# EAGLE design Orange Board (EAGLE 8.4.3)

## Sheet 1 of 3
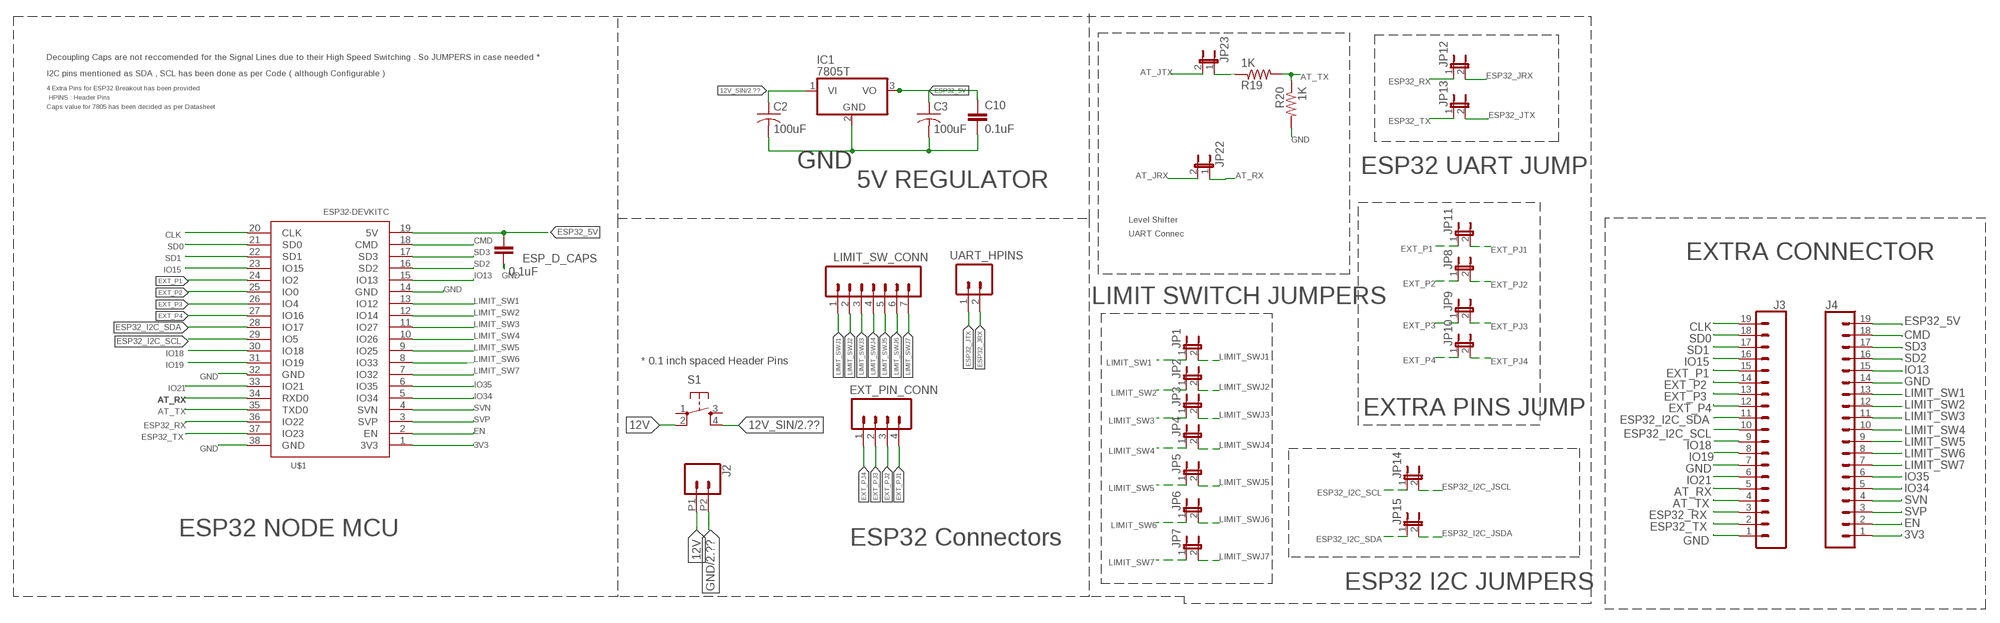
[diagram p0: schematic, sheet 1]

### Parts
C2  100uF  C-US025-024X044  [C025-024X044]
C3  100uF  C-US025-024X044  [C025-024X044]
C10  0.1uF  0.1UF-KIT-EZ-50V-20%  [CAP-PTH-SMALL-KIT]
ESP_D_CAPS  0.1uF  0.1UF-KIT-EZ-50V-20%  [CAP-PTH-SMALL-KIT]
EXT_PIN_CONN  CONN_04  [1X04]
IC1  7805T  [TO220H]
J2  CONN_022.54MM_SCREWTERM  [1X02_2.54_SCREWTERM]
J3  CONN_19  [1X19]
J4  CONN_19  [1X19]
JP1  JUMPER-2PTH  [1X02]
JP2  JUMPER-2PTH  [1X02]
JP3  JUMPER-2PTH  [1X02]
JP4  JUMPER-2PTH  [1X02]
JP5  JUMPER-2PTH  [1X02]
JP6  JUMPER-2PTH  [1X02]
JP7  JUMPER-2PTH  [1X02]
JP8  JUMPER-2PTH  [1X02]
JP9  JUMPER-2PTH  [1X02]
JP10  JUMPER-2PTH  [1X02]
JP11  JUMPER-2PTH  [1X02]
JP12  JUMPER-2PTH  [1X02]
JP13  JUMPER-2PTH  [1X02]
JP14  JUMPER-2PTH  [1X02]
JP15  JUMPER-2PTH  [1X02]
JP22  JUMPER-2PTH  [1X02]
JP23  JUMPER-2PTH  [1X02]
LIMIT_SW_CONN  CONN_07  [1X07]
R19  1K  R-US_0204/5  [0204/5]
R20  1K  R-US_0204/5  [0204/5]
S1  TAC_SWITCHPTH  [TACTILE-PTH]
U$1  ESP32DEVKITC  [ESP32-DEVKITC]
UART_HPINS  CONN_02  [1X02]

### Nets
3V3: J4.1 U$1.1(3V3)
12V: J2.P1 S1.2
12V_SIN: C2.1 IC1.1(VI) S1.4 ; also sheet 2,3
AT_JRX: JP22.2 ; also sheet 3
AT_JTX: JP23.2 ; also sheet 3
AT_RX: J3.5 JP22.1 U$1.34(RXD0)
AT_TX: J3.4 R19.2 R20.1 U$1.35(TXD0)
CLK: J3.19 U$1.20(CLK)
CMD: J4.18 U$1.18(CMD)
EN: J4.2 U$1.2(EN)
ESP32_5V: C3.1 C10.1 ESP_D_CAPS.1 IC1.3(VO) J4.19 U$1.19(5V)
ESP32_I2C_JSCL: JP14.2 ; also sheet 2
ESP32_I2C_JSDA: JP15.2 ; also sheet 2
ESP32_I2C_SCL: J3.10 JP14.1 U$1.29(IO5)
ESP32_I2C_SDA: J3.11 JP15.1 U$1.28(IO17)
ESP32_JRX: JP12.2 UART_HPINS.2
ESP32_JTX: JP13.2 UART_HPINS.1
ESP32_RX: J3.3 JP12.1 U$1.36(IO22)
ESP32_TX: J3.2 JP13.1 U$1.37(IO23)
EXT_P1: J3.15 JP11.1 U$1.24(IO2)
EXT_P2: J3.14 JP8.1 U$1.25(IO0)
EXT_P3: J3.13 JP9.1 U$1.26(IO4)
EXT_P4: J3.12 JP10.1 U$1.27(IO16)
EXT_PJ1: EXT_PIN_CONN.4 JP11.2
EXT_PJ2: EXT_PIN_CONN.3 JP8.2
EXT_PJ3: EXT_PIN_CONN.2 JP9.2
EXT_PJ4: EXT_PIN_CONN.1 JP10.2
GND: C2.2 C3.2 C10.2 ESP_D_CAPS.2 IC1.2(GND) J2.P2 J3.1 J3.7 J4.14 R20.2 U$1.14(GND) U$1.32(GND) U$1.38(GND) ; also sheet 2,3
IO13: J4.15 U$1.15(IO13)
IO15: J3.16 U$1.23(IO15)
IO18: J3.9 U$1.30(IO18)
IO19: J3.8 U$1.31(IO19)
IO21: J3.6 U$1.33(IO21)
IO34: J4.5 U$1.5(IO34)
IO35: J4.6 U$1.6(IO35)
LIMIT_SW1: J4.13 JP1.1 U$1.13(IO12)
LIMIT_SW2: J4.12 JP2.1 U$1.12(IO14)
LIMIT_SW3: J4.11 JP3.1 U$1.11(IO27)
LIMIT_SW4: J4.10 JP4.1 U$1.10(IO26)
LIMIT_SW5: J4.9 JP5.1 U$1.9(IO25)
LIMIT_SW6: J4.8 JP6.1 U$1.8(IO33)
LIMIT_SW7: J4.7 JP7.1 U$1.7(IO32)
LIMIT_SWJ1: JP1.2 LIMIT_SW_CONN.1
LIMIT_SWJ2: JP2.2 LIMIT_SW_CONN.2
LIMIT_SWJ3: JP3.2 LIMIT_SW_CONN.3
LIMIT_SWJ4: JP4.2 LIMIT_SW_CONN.4
LIMIT_SWJ5: JP5.2 LIMIT_SW_CONN.5
LIMIT_SWJ6: JP6.2 LIMIT_SW_CONN.6
LIMIT_SWJ7: JP7.2 LIMIT_SW_CONN.7
N$16: JP23.1 R19.1
SD0: J3.18 U$1.21(SD0)
SD1: J3.17 U$1.22(SD1)
SD2: J4.16 U$1.16(SD2)
SD3: J4.17 U$1.17(SD3)
SVN: J4.4 U$1.4(SVN)
SVP: J4.3 U$1.3(SVP)
Unconnected: S1.1 S1.3

### Notes on the sheet
- Decoupling Caps are not reccomended for the Signal Lines due to their High Speed Switching . So JUMPERS in case needed *
- I2C pins mentioned as SDA , SCL has been done as per Code ( although Configurable )
- 4 Extra Pins for ESP32 Breakout has been provided
- HPINS : Header Pins
- Caps value for 7805 has been decided as per Datasheet
- ESP32 UART JUMP
- 5V REGULATOR
- Level Shifter
- UART Connec
- EXTRA CONNECTOR
- LIMIT SWITCH JUMPERS
- * 0.1 inch spaced Header Pins
- EXTRA PINS JUMP
- ESP32 NODE MCU
- ESP32 Connectors
- ESP32 I2C JUMPERS

## Sheet 2 of 3
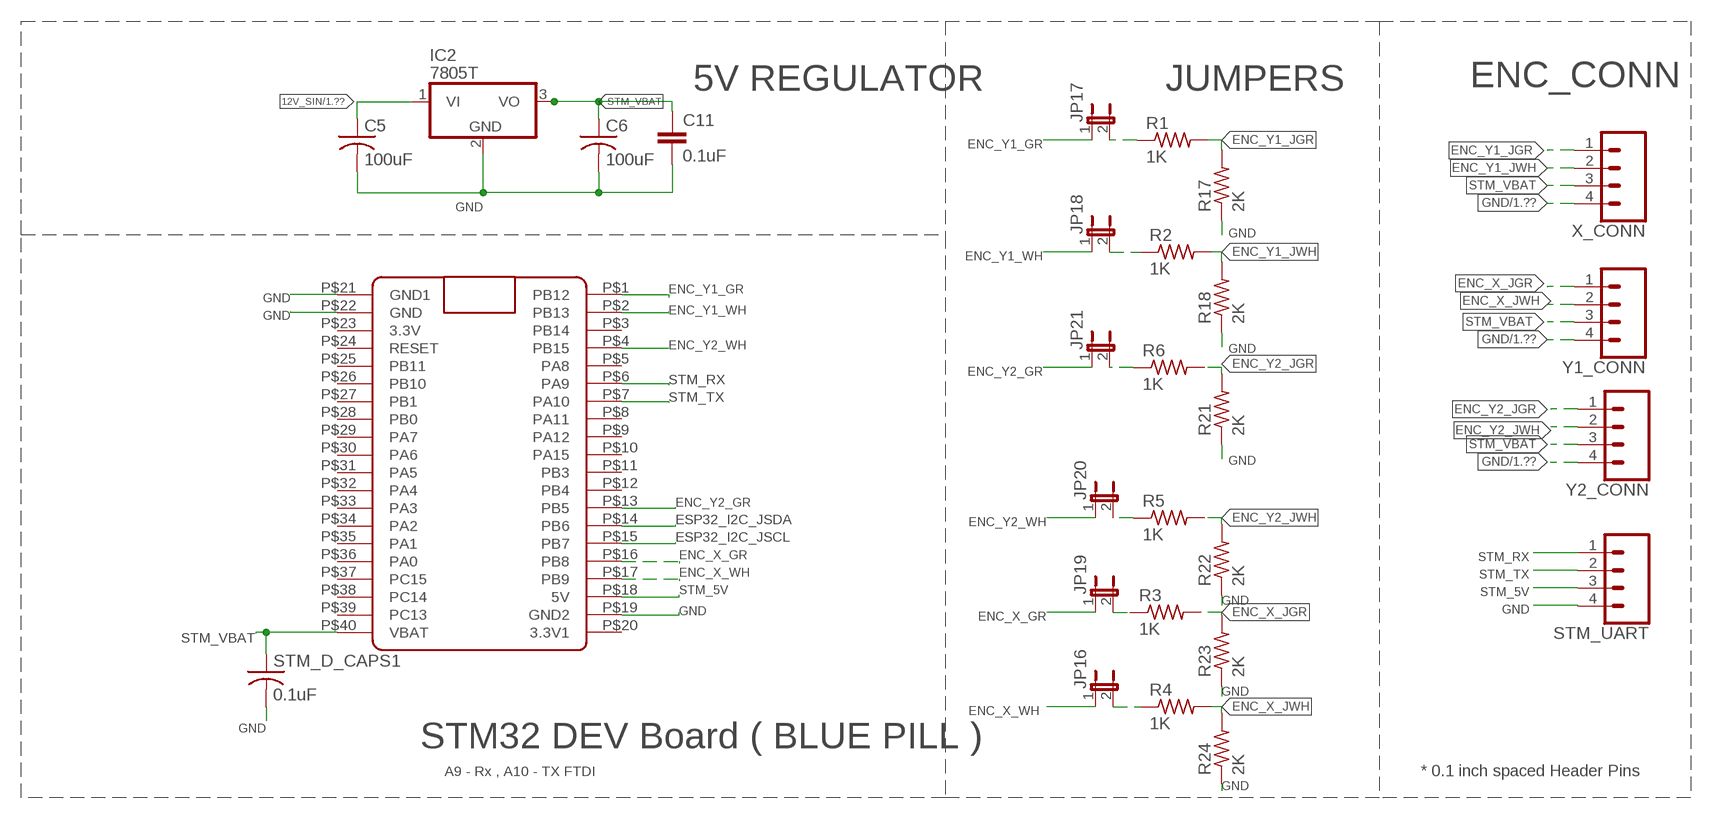
[diagram p1: schematic, sheet 2]

### Parts
C5  100uF  C-US025-024X044  [C025-024X044]
C6  100uF  C-US025-024X044  [C025-024X044]
C11  0.1uF  0.1UF-KIT-EZ-50V-20%  [CAP-PTH-SMALL-KIT]
IC2  7805T  [TO220H]
JP16  JUMPER-2PTH  [1X02]
JP17  JUMPER-2PTH  [1X02]
JP18  JUMPER-2PTH  [1X02]
JP19  JUMPER-2PTH  [1X02]
JP20  JUMPER-2PTH  [1X02]
JP21  JUMPER-2PTH  [1X02]
R1  1K  R-US_0204/5  [0204/5]
R2  1K  R-US_0204/5  [0204/5]
R3  1K  R-US_0204/5  [0204/5]
R4  1K  R-US_0204/5  [0204/5]
R5  1K  R-US_0204/5  [0204/5]
R6  1K  R-US_0204/5  [0204/5]
R17  2K  R-US_0204/5  [0204/5]
R18  2K  R-US_0204/5  [0204/5]
R21  2K  R-US_0204/5  [0204/5]
R22  2K  R-US_0204/5  [0204/5]
R23  2K  R-US_0204/5  [0204/5]
R24  2K  R-US_0204/5  [0204/5]
STM_D_CAPS1  0.1uF  C-US025-024X044  [C025-024X044]
STM_UART  CONN_04  [1X04]
U$2  BLUE_PILLADVANCED  [BLUE_PILL_ADV]
X_CONN  CONN_04  [1X04]
Y1_CONN  CONN_04  [1X04]
Y2_CONN  CONN_04  [1X04]

### Nets
12V_SIN: C5.1 IC2.1(VI) ; also sheet 1,3
ENC_X_GR: JP19.1 U$2.P$16(PB8)
ENC_X_JGR: R3.2 R23.2 Y1_CONN.1
ENC_X_JWH: R4.2 R24.2 Y1_CONN.2
ENC_X_WH: JP16.1 U$2.P$17(PB9)
ENC_Y1_GR: JP17.1 U$2.P$1(PB12)
ENC_Y1_JGR: R1.2 R17.2 X_CONN.1
ENC_Y1_JWH: R2.2 R18.2 X_CONN.2
ENC_Y1_WH: JP18.1 U$2.P$2(PB13)
ENC_Y2_GR: JP21.1 U$2.P$13(PB5)
ENC_Y2_JGR: R6.2 R21.2 Y2_CONN.1
ENC_Y2_JWH: R5.2 R22.2 Y2_CONN.2
ENC_Y2_WH: JP20.1 U$2.P$4(PB15)
ESP32_I2C_JSCL: U$2.P$15(PB7) ; also sheet 1
ESP32_I2C_JSDA: U$2.P$14(PB6) ; also sheet 1
GND: C5.2 C6.2 C11.2 IC2.2(GND) R17.1 R18.1 R21.1 R22.1 R23.1 R24.1 STM_D_CAPS1.2 STM_UART.4 U$2.P$19(GND2) U$2.P$21(GND1) U$2.P$22(GND) X_CONN.4 Y1_CONN.4 Y2_CONN.4 ; also sheet 1,3
N$14: JP19.2 R3.1
N$15: JP16.2 R4.1
N$17: JP18.2 R2.1
N$18: JP17.2 R1.1
N$19: JP21.2 R6.1
N$20: JP20.2 R5.1
STM_5V: STM_UART.3 U$2.P$18(5V)
STM_RX: STM_UART.1 U$2.P$6(PA9)
STM_TX: STM_UART.2 U$2.P$7(PA10)
STM_VBAT: C6.1 C11.1 IC2.3(VO) STM_D_CAPS1.1 U$2.P$40(VBAT) X_CONN.3 Y1_CONN.3 Y2_CONN.3
Unconnected: U$2.P$3(PB14) U$2.P$5(PA8) U$2.P$8(PA11) U$2.P$9(PA12) U$2.P$10(PA15) U$2.P$11(PB3) U$2.P$12(PB4) U$2.P$20(3.3V1) U$2.P$23(3.3V) U$2.P$24(RESET) U$2.P$25(PB11) U$2.P$26(PB10) U$2.P$27(PB1) U$2.P$28(PB0) U$2.P$29(PA7) U$2.P$30(PA6) U$2.P$31(PA5) U$2.P$32(PA4) U$2.P$33(PA3) U$2.P$34(PA2) U$2.P$35(PA1) U$2.P$36(PA0) U$2.P$37(PC15) U$2.P$38(PC14) U$2.P$39(PC13)

### Notes on the sheet
- 5V REGULATOR | JUMPERS | ENC_CONN
- STM32 DEV Board ( BLUE PILL )
- A9 - Rx , A10 - TX FTDI | * 0.1 inch spaced Header Pins

## Sheet 3 of 3
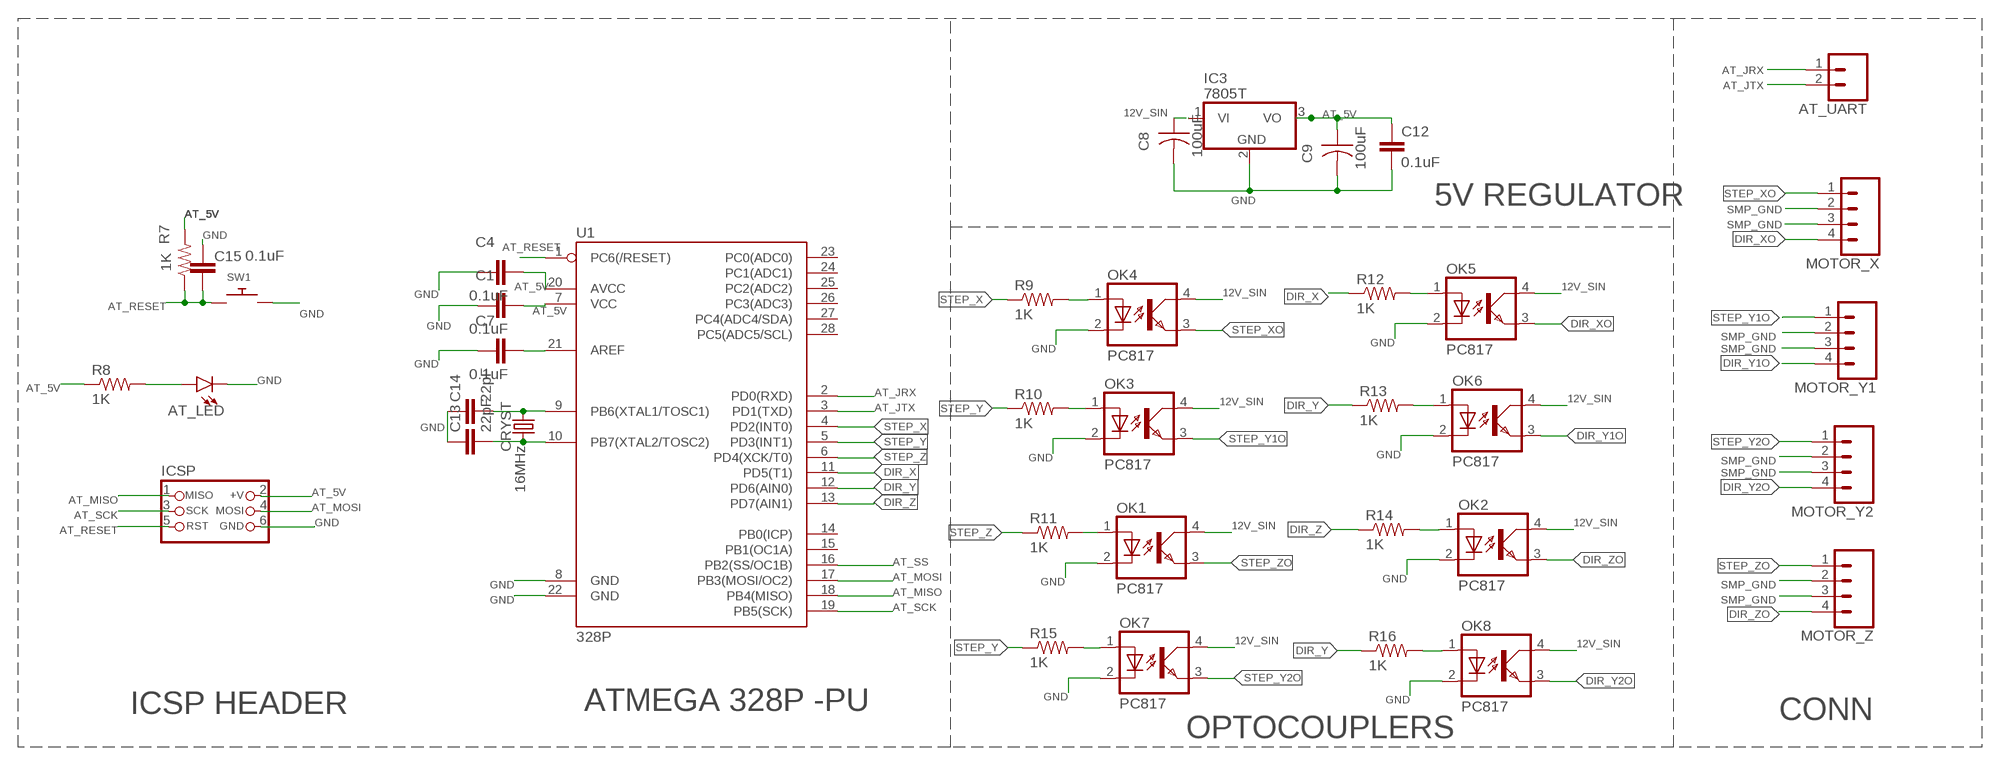
[diagram p2: schematic, sheet 3]

### Parts
AT_LED  LED-3MM-NO_SILK  [LED_3MM-NS]
AT_UART  CONN_02  [1X02]
C1  0.1uF  0.1UF-KIT-EZ-50V-20%  [CAP-PTH-SMALL-KIT]
C4  0.1uF  0.1UF-KIT-EZ-50V-20%  [CAP-PTH-SMALL-KIT]
C7  0.1uF  0.1UF-KIT-EZ-50V-20%  [CAP-PTH-SMALL-KIT]
C8  100uF  C-US025-024X044  [C025-024X044]
C9  100uF  C-US025-024X044  [C025-024X044]
C12  0.1uF  0.1UF-KIT-EZ-50V-20%  [CAP-PTH-SMALL-KIT]
C13  22pF  22PF-PTH-2.54MM-200V-5%  [CAP-PTH-2.54]
C14  22pF  22PF-PTH-2.54MM-200V-5%  [CAP-PTH-2.54]
C15  0.1uF  0.1UF-KIT-EZ-50V-20%  [CAP-PTH-SMALL-KIT]
CRYST  16MHz  CRYSTAL-16MHZPTH-HC49US  [HC49US]
IC3  7805T  [TO220H]
ICSP  CON_HEADER_PRG_AVR_ICSP-PTH  [HEADER_PRG_2X03]
MOTOR_X  CONN_04  [1X04]
MOTOR_Y1  CONN_04  [1X04]
MOTOR_Y2  CONN_04  [1X04]
MOTOR_Z  CONN_04  [1X04]
OK1  PC817  [DIL04]
OK2  PC817  [DIL04]
OK3  PC817  [DIL04]
OK4  PC817  [DIL04]
OK5  PC817  [DIL04]
OK6  PC817  [DIL04]
OK7  PC817  [DIL04]
OK8  PC817  [DIL04]
R7  1K  R-US_0204/5  [0204/5]
R8  1K  R-US_0204/5  [0204/5]
R9  1K  R-US_0204/5  [0204/5]
R10  1K  R-US_0204/5  [0204/5]
R11  1K  R-US_0204/5  [0204/5]
R12  1K  R-US_0204/5  [0204/5]
R13  1K  R-US_0204/5  [0204/5]
R14  1K  R-US_0204/5  [0204/5]
R15  1K  R-US_0204/5  [0204/5]
R16  1K  R-US_0204/5  [0204/5]
SW1  SWITCH_PUSHBUTTONEVQ-PE  [TACT_PANA-EVQ]
U1  328P  ATMEGA328P_PDIP  [DIP28]

### Nets
12V_SIN: C8.1 IC3.1(VI) OK1.4(COL) OK2.4(COL) OK3.4(COL) OK4.4(COL) OK5.4(COL) OK6.4(COL) OK7.4(COL) OK8.4(COL) ; also sheet 1,2
AT_5V: C1.1 C4.1 C9.1 C12.1 IC3.3(VO) ICSP.2(+V) R7.2 R8.1 U1.7(VCC) U1.20(AVCC)
AT_JRX: AT_UART.1 U1.2(PD0(RXD)) ; also sheet 1
AT_JTX: AT_UART.2 U1.3(PD1(TXD)) ; also sheet 1
AT_MISO: ICSP.1(MISO) U1.18(PB4(MISO))
AT_MOSI: ICSP.4(MOSI) U1.17(PB3(MOSI/OC2))
AT_RESET: C15.1 ICSP.5(RST) R7.1 SW1.P$1 U1.1(PC6(/RESET))
AT_SCK: ICSP.3(SCK) U1.19(PB5(SCK))
AT_SS: U1.16(PB2(SS/OC1B))
DIR_X: R12.1 U1.11(PD5(T1))
DIR_XO: MOTOR_X.4 OK5.3(EMIT)
DIR_Y: R13.1 R16.1 U1.12(PD6(AIN0))
DIR_Y1O: MOTOR_Y1.4 OK6.3(EMIT)
DIR_Y2O: MOTOR_Y2.4 OK8.3(EMIT)
DIR_Z: R14.1 U1.13(PD7(AIN1))
DIR_ZO: MOTOR_Z.4 OK2.3(EMIT)
GND: AT_LED.K(C) C1.2 C4.2 C7.2 C8.2 C9.2 C12.2 C13.1 C14.1 C15.2 IC3.2(GND) ICSP.6(GND) OK1.2(C) OK2.2(C) OK3.2(C) OK4.2(C) OK5.2(C) OK6.2(C) OK7.2(C) OK8.2(C) SW1.P$2 U1.8(GND) U1.22(GND) ; also sheet 1,2
N$1: C13.2 CRYST.1 U1.10(PB7(XTAL2/TOSC2))
N$2: C14.2 CRYST.2 U1.9(PB6(XTAL1/TOSC1))
N$3: AT_LED.A R8.2
N$5: C7.1 U1.21(AREF)
N$6: OK4.1(A) R9.2
N$7: OK3.1(A) R10.2
N$8: OK1.1(A) R11.2
N$9: OK5.1(A) R12.2
N$10: OK2.1(A) R14.2
N$11: OK6.1(A) R13.2
N$12: OK7.1(A) R15.2
N$13: OK8.1(A) R16.2
SMP_GND: MOTOR_X.2 MOTOR_X.3 MOTOR_Y1.2 MOTOR_Y1.3 MOTOR_Y2.2 MOTOR_Y2.3 MOTOR_Z.2 MOTOR_Z.3
STEP_X: R9.1 U1.4(PD2(INT0))
STEP_XO: MOTOR_X.1 OK4.3(EMIT)
STEP_Y: R10.1 R15.1 U1.5(PD3(INT1))
STEP_Y1O: MOTOR_Y1.1 OK3.3(EMIT)
STEP_Y2O: MOTOR_Y2.1 OK7.3(EMIT)
STEP_Z: R11.1 U1.6(PD4(XCK/T0))
STEP_ZO: MOTOR_Z.1 OK1.3(EMIT)
Unconnected: U1.14(PB0(ICP)) U1.15(PB1(OC1A)) U1.23(PC0(ADC0)) U1.24(PC1(ADC1)) U1.25(PC2(ADC2)) U1.26(PC3(ADC3)) U1.27(PC4(ADC4/SDA)) U1.28(PC5(ADC5/SCL))

### Notes on the sheet
- 5V REGULATOR
- ICSP HEADER | ATMEGA 328P -PU | CONN
- OPTOCOUPLERS

## Library data of the parts
AT_LED = SparkFun-LED:LED: LED (Generic) Standard schematic elements and footprints for 5mm, 3mm, 1206, and 0603 sized LEDs. Generic LEDs with no color specified.
AT_UART J2 UART_HPINS = SparkFun-Connectors:CONN_02: Multi connection point. Often used as Generic Header-pin footprint for 0.1 inch spaced/style header connections On any of the 0.1 inch spaced packages, you can populate with these: Break Away Headers - Straight <https://www.sparkfun.com/products/116> (PRT-00116) Break Away Male Headers - Right Angle <https://www.sparkfun.com/products/553> (PRT-00553) Female Headers <https://www.sparkfun.com/products/115> (PRT-00115) Break Away Headers - Machine Pin <https://www.sparkfun.com/products/117> (PRT-00117) Break Away Female Headers - Swiss Machine Pin <https://www.sparkfun.com/products/743> (PRT-00743) For SCREWTERMINALS and SPRING TERMINALS visit here: Screw Terimnals on SparkFun.com <https://www.sparkfun.com/search/results?term=Screw+Terminals> (5mm/3.5mm/2.54mm spacing) This device is also useful as a general connection point to wire up your design to another part of your project. Our various solder wires solder well into these plated through hole pads. Hook-Up Wire - Assortment (Stranded, 22 AWG) <https://www.sparkfun.com/products/11375> (PRT-11375) Hook-Up Wire - Assortment (Solid Core, 22 AWG) <https://www.sparkfun.com/products/11367> (PRT-11367) View the entire wire category on our website here <https://www.sparkfun.com/categories/141> Special notes: Molex polarized connector foot print use with: PRT-08233 with associated crimp pins and housings. 2.54_SCREWTERM for use with PRT-10571. 3.5mm Screw Terminal footprints for PRT-08084 5mm Screw Terminal footprints for use with PRT-08432
C1 C4 C7 C10-C12 C15 ESP_D_CAPS = SparkFun-Capacitors:0.1UF: 0.1µF ceramic capacitors A capacitor is a passive two-terminal electrical component used to store electrical energy temporarily in an electric field.; PROD_ID: CAP-08370
C2 C3 C5 C6 C8 C9 STM_D_CAPS1 = adafruit:C-US: CAPACITOR, American symbol
C13 C14 = SparkFun-Capacitors:22PF: 22pF ceramic capacitors A capacitor is a passive two-terminal electrical component used to store electrical energy temporarily in an electric field.; PROD_ID: CAP-09128
CRYST = SparkFun-Clocks:CRYSTAL-16MHZ: 16MHz Crystal Digikey Example <http://www.digikey.com/product-search/en?keywords=535-9122-1-ND> Frequency: 16MHz Frequency Stability: ±50ppm Frequency Tolerance: ±20ppm Load Capacitance: 18pF SparkFun Products: Pro Micro -5V/16MHz <https://www.sparkfun.com/products/12640> SparkFun Serial Enabled LCD Kit <https://www.sparkfun.com/products/10097>; PROD_ID: XTAL-08181; SF_ID: COM-00536
EXT_PIN_CONN MOTOR_X MOTOR_Y1 MOTOR_Y2 MOTOR_Z STM_UART X_CONN Y1_CONN Y2_CONN = SparkFun-Connectors:CONN_04: Multi connection point. Often used as Generic Header-pin footprint for 0.1 inch spaced/style header connections On any of the 0.1 inch spaced packages, you can populate with these: Break Away Headers - Straight <https://www.sparkfun.com/products/116> (PRT-00116) Break Away Male Headers - Right Angle <https://www.sparkfun.com/products/553> (PRT-00553) Female Headers <https://www.sparkfun.com/products/115> (PRT-00115) Break Away Headers - Machine Pin <https://www.sparkfun.com/products/117> (PRT-00117) Break Away Female Headers - Swiss Machine Pin <https://www.sparkfun.com/products/743> (PRT-00743) For SCREWTERMINALS and SPRING TERMINALS visit here: Screw Terimnals on SparkFun.com <https://www.sparkfun.com/search/results?term=Screw+Terminals> (5mm/3.5mm/2.54mm spacing) This device is also useful as a general connection point to wire up your design to another part of your project. Our various solder wires solder well into these plated through hole pads. Hook-Up Wire - Assortment (Stranded, 22 AWG) <https://www.sparkfun.com/products/11375> (PRT-11375) Hook-Up Wire - Assortment (Solid Core, 22 AWG) <https://www.sparkfun.com/products/11367> (PRT-11367) View the entire wire category on our website here <https://www.sparkfun.com/categories/141> Special notes: Molex polarized connector foot print use with SKU : PRT-08231 with associated crimp pins and housings. 1MM SMD Version SKU: PRT-10208; PROD_ID: CONN-09696
IC1-IC3 = adafruit:78*: Positive VOLTAGE REGULATOR Added bigger pads to the TO-92 package
ICSP = dp_devices:CON_HEADER_PRG_AVR_ICSP: 2x3 AVR ICSP programming header
J3 J4 = SparkFun-Connectors:CONN_19: Multi connection point. Often used as Generic Header-pin footprint for 0.1 inch spaced/style header connections On any of the 0.1 inch spaced packages, you can populate with these: Break Away Headers - Straight <https://www.sparkfun.com/products/116> (PRT-00116) Break Away Male Headers - Right Angle <https://www.sparkfun.com/products/553> (PRT-00553) Female Headers <https://www.sparkfun.com/products/115> (PRT-00115) Break Away Headers - Machine Pin <https://www.sparkfun.com/products/117> (PRT-00117) Break Away Female Headers - Swiss Machine Pin <https://www.sparkfun.com/products/743> (PRT-00743) For SCREWTERMINALS and SPRING TERMINALS visit here: Screw Terimnals on SparkFun.com <https://www.sparkfun.com/search/results?term=Screw+Terminals> (5mm/3.5mm/2.54mm spacing) This device is also useful as a general connection point to wire up your design to another part of your project. Our various solder wires solder well into these plated through hole pads. Hook-Up Wire - Assortment (Stranded, 22 AWG) <https://www.sparkfun.com/products/11375> (PRT-11375) Hook-Up Wire - Assortment (Solid Core, 22 AWG) <https://www.sparkfun.com/products/11367> (PRT-11367) View the entire wire category on our website here <https://www.sparkfun.com/categories/141> Special notes: Molex polarized connector foot print use with SKU : PRT-08231 with associated crimp pins and housings. 1MM SMD Version SKU: PRT-10208 NOTES ON THE VARIANTS LOCK and LOCK_LONGPADS... This footprint was designed to help hold the alignment of a through-hole component (i.e. 6-pin header) while soldering it into place. You may notice that each hole has been shifted either up or down by 0.005 of an inch from it's more standard position (which is a perfectly straight line). This slight alteration caused the pins (the squares in the middle) to touch the edges of the holes. Because they are alternating, it causes a "brace" to hold the component in place. 0.005 has proven to be the perfect amount of "off-center" position when using our standard breakaway headers. Although looks a little odd when you look at the bare footprint, once you have a header in there, the alteration is very hard to notice. Also,if you push a header all the way into place, it is covered up entirely on the bottom side.
JP1-JP23 = SparkFun-Retired:JUMPER-2: Jumper Basic 0.1" spaced jumper. Use with breakaway headers.
LIMIT_SW_CONN = SparkFun-Connectors:CONN_07: Multi connection point. Often used as Generic Header-pin footprint for 0.1 inch spaced/style header connections On any of the 0.1 inch spaced packages, you can populate with these: Break Away Headers - Straight <https://www.sparkfun.com/products/116> (PRT-00116) Break Away Male Headers - Right Angle <https://www.sparkfun.com/products/553> (PRT-00553) Female Headers <https://www.sparkfun.com/products/115> (PRT-00115) Break Away Headers - Machine Pin <https://www.sparkfun.com/products/117> (PRT-00117) Break Away Female Headers - Swiss Machine Pin <https://www.sparkfun.com/products/743> (PRT-00743) For SCREWTERMINALS and SPRING TERMINALS visit here: Screw Terimnals on SparkFun.com <https://www.sparkfun.com/search/results?term=Screw+Terminals> (5mm/3.5mm/2.54mm spacing) This device is also useful as a general connection point to wire up your design to another part of your project. Our various solder wires solder well into these plated through hole pads. Hook-Up Wire - Assortment (Stranded, 22 AWG) <https://www.sparkfun.com/products/11375> (PRT-11375) Hook-Up Wire - Assortment (Solid Core, 22 AWG) <https://www.sparkfun.com/products/11367> (PRT-11367) View the entire wire category on our website here <https://www.sparkfun.com/categories/141> Special notes: Molex polarized connector foot print use with SKU : PRT-08231 with associated crimp pins and housings. 1MM SMD Version SKU: PRT-10208 NOTES ON THE VARIANTS LOCK and LOCK_LONGPADS... This footprint was designed to help hold the alignment of a through-hole component (i.e. 6-pin header) while soldering it into place. You may notice that each hole has been shifted either up or down by 0.005 of an inch from it's more standard position (which is a perfectly straight line). This slight alteration caused the pins (the squares in the middle) to touch the edges of the holes. Because they are alternating, it causes a "brace" to hold the component in place. 0.005 has proven to be the perfect amount of "off-center" position when using our standard breakaway headers. Although looks a little odd when you look at the bare footprint, once you have a header in there, the alteration is very hard to notice. Also,if you push a header all the way into place, it is covered up entirely on the bottom side.
OK1-OK8 = optocoupler:PC817: SHARP OPTO COUPLER; MPN: PC817X4J000F; OC_FARNELL: 9707727; OC_NEWARK: 97K7059
R1-R24 = resistor:R-US_: RESISTOR, American symbol
S1 = SparkFun-Retired:TAC_SWITCH: Momentary Switch Button commonly used for reset or general input. Spark Fun Electronics SKU : COM-00097 SMT- SWCH-08247
SW1 = adafruit:SWITCH_PUSHBUTTON: Buttons SOFTTOUCHSMD_SJ - Soft touch temporary push button (Super Junk Akihabara) Compatible with SKPMANE010 [Mouser: 688-SKPMAN] C&K_KSS = Digikey: KSS221GLFS
U1 = SparkFun-IC-Microcontroller:ATMEGA328P_PDIP: Atmel 328P Through hole ATMEGA328P uC used in the Arduino 32kb flash, 1k EEPROM, 2k SRAM Datasheet <http://www.sparkfun.com/datasheets/Components/SMD/ATMega328.pdf> SparkFun Products Storefront component: AVR 28 Pin 20MHz 32K 6A/D - ATMega328P <https://www.sparkfun.com/products/9061> (COM-09061) SparkFun Simon Says - Through-Hole Soldering Kit <https://www.sparkfun.com/products/10547> (KIT-10547) SparkFun Learn to Solder - Simon Says <https://www.sparkfun.com/products/13708> (KIT-13708) SparkFun BigTime Watch Kit <https://www.sparkfun.com/products/11734> (KIT-11734) SparkFun ClockIt <https://www.sparkfun.com/products/10930> (KIT-10930) SparkFun Serial Enabled LCD Kit <https://www.sparkfun.com/products/10097> (LCD-10097) SparkFun Simon Tilts - Through Hole Soldering Kit <https://www.sparkfun.com/products/12634> (KIT-12634) SparkFun Frequency Counter Kit <https://www.sparkfun.com/products/10140> (KIT-10140) FabFM Radio Kit <https://www.sparkfun.com/products/11043> (KIT-11043) SparkFun Binary Blaster Kit <https://www.sparkfun.com/products/12037> (KIT-12037) SparkFun Metro-Gnome <https://www.sparkfun.com/products/9236> (KIT-09236) ATmega328 with Arduino Optiboot (Uno) <https://www.sparkfun.com/products/10524> (DEV-10524); PROD_ID: IC-09136
U$1 = ESP32-DEVKITC:ESP32DEVKITC
U$2 = BluePill:BLUE_PILL

## Board
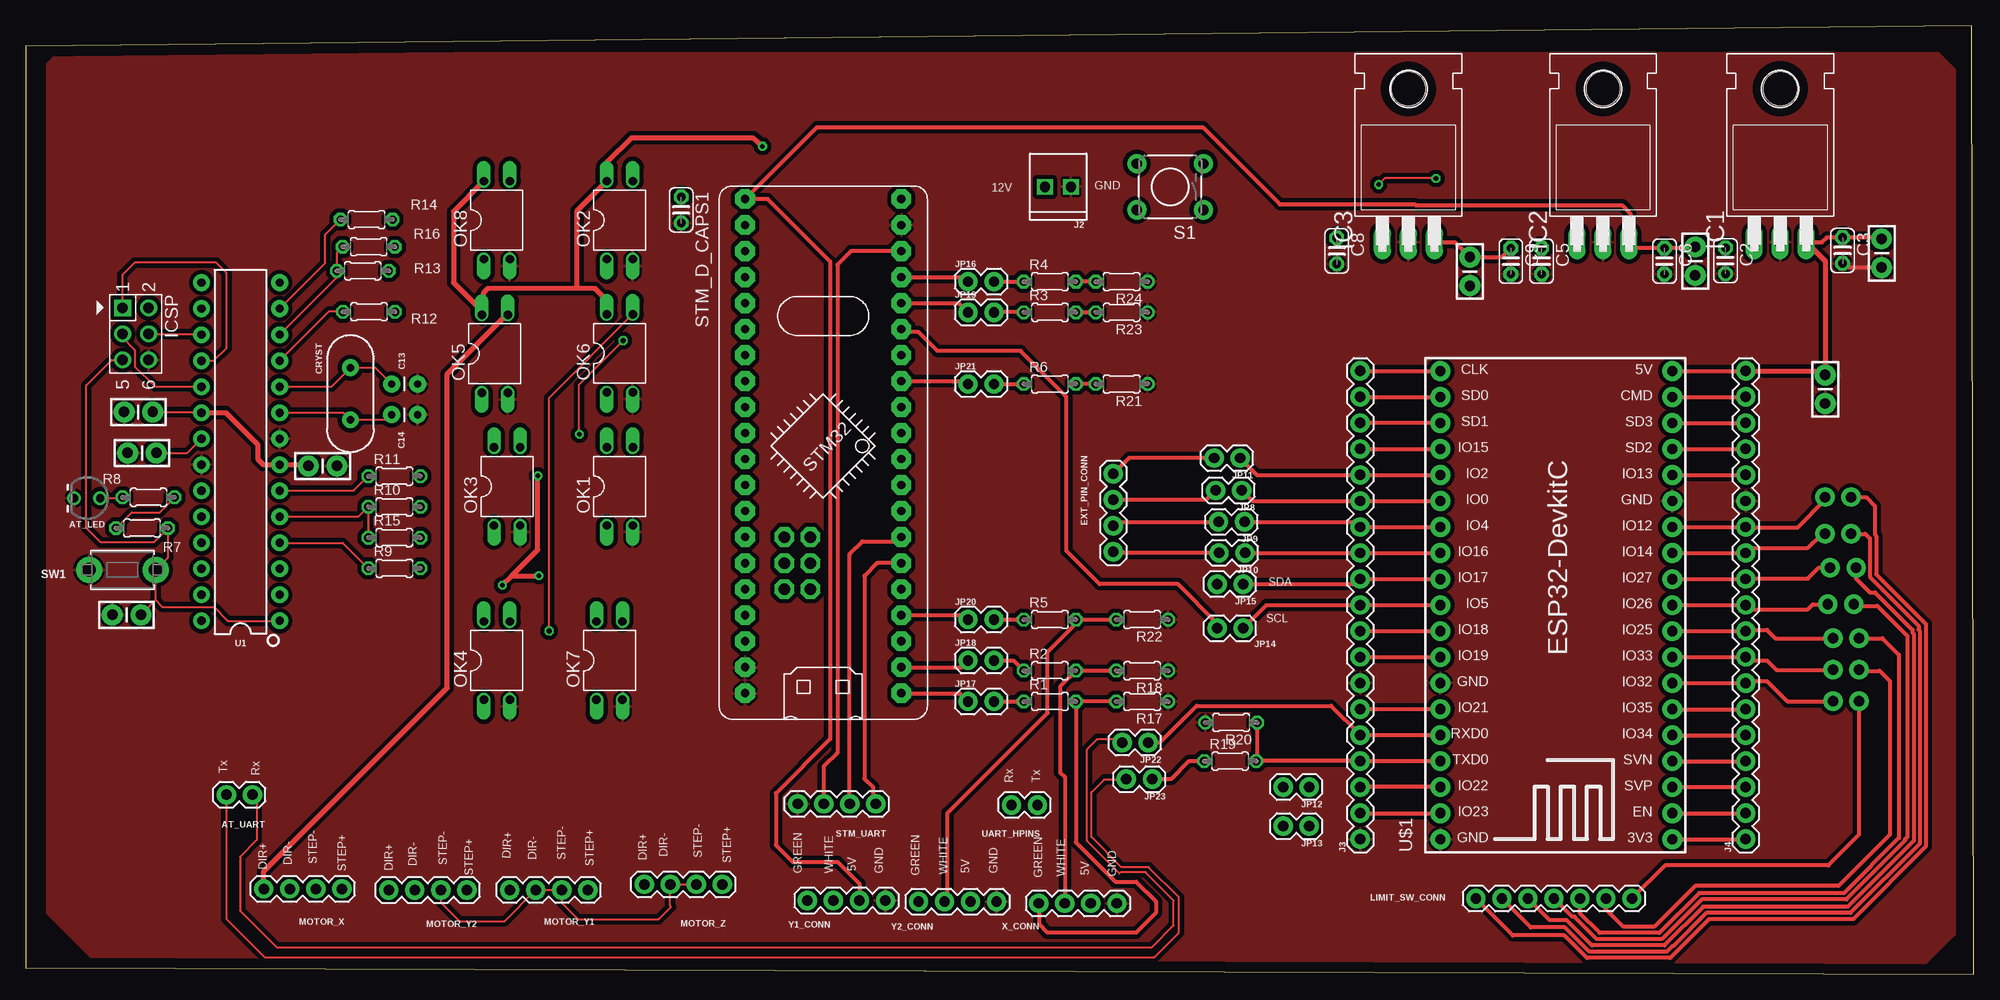
[diagram p3: board, top side]
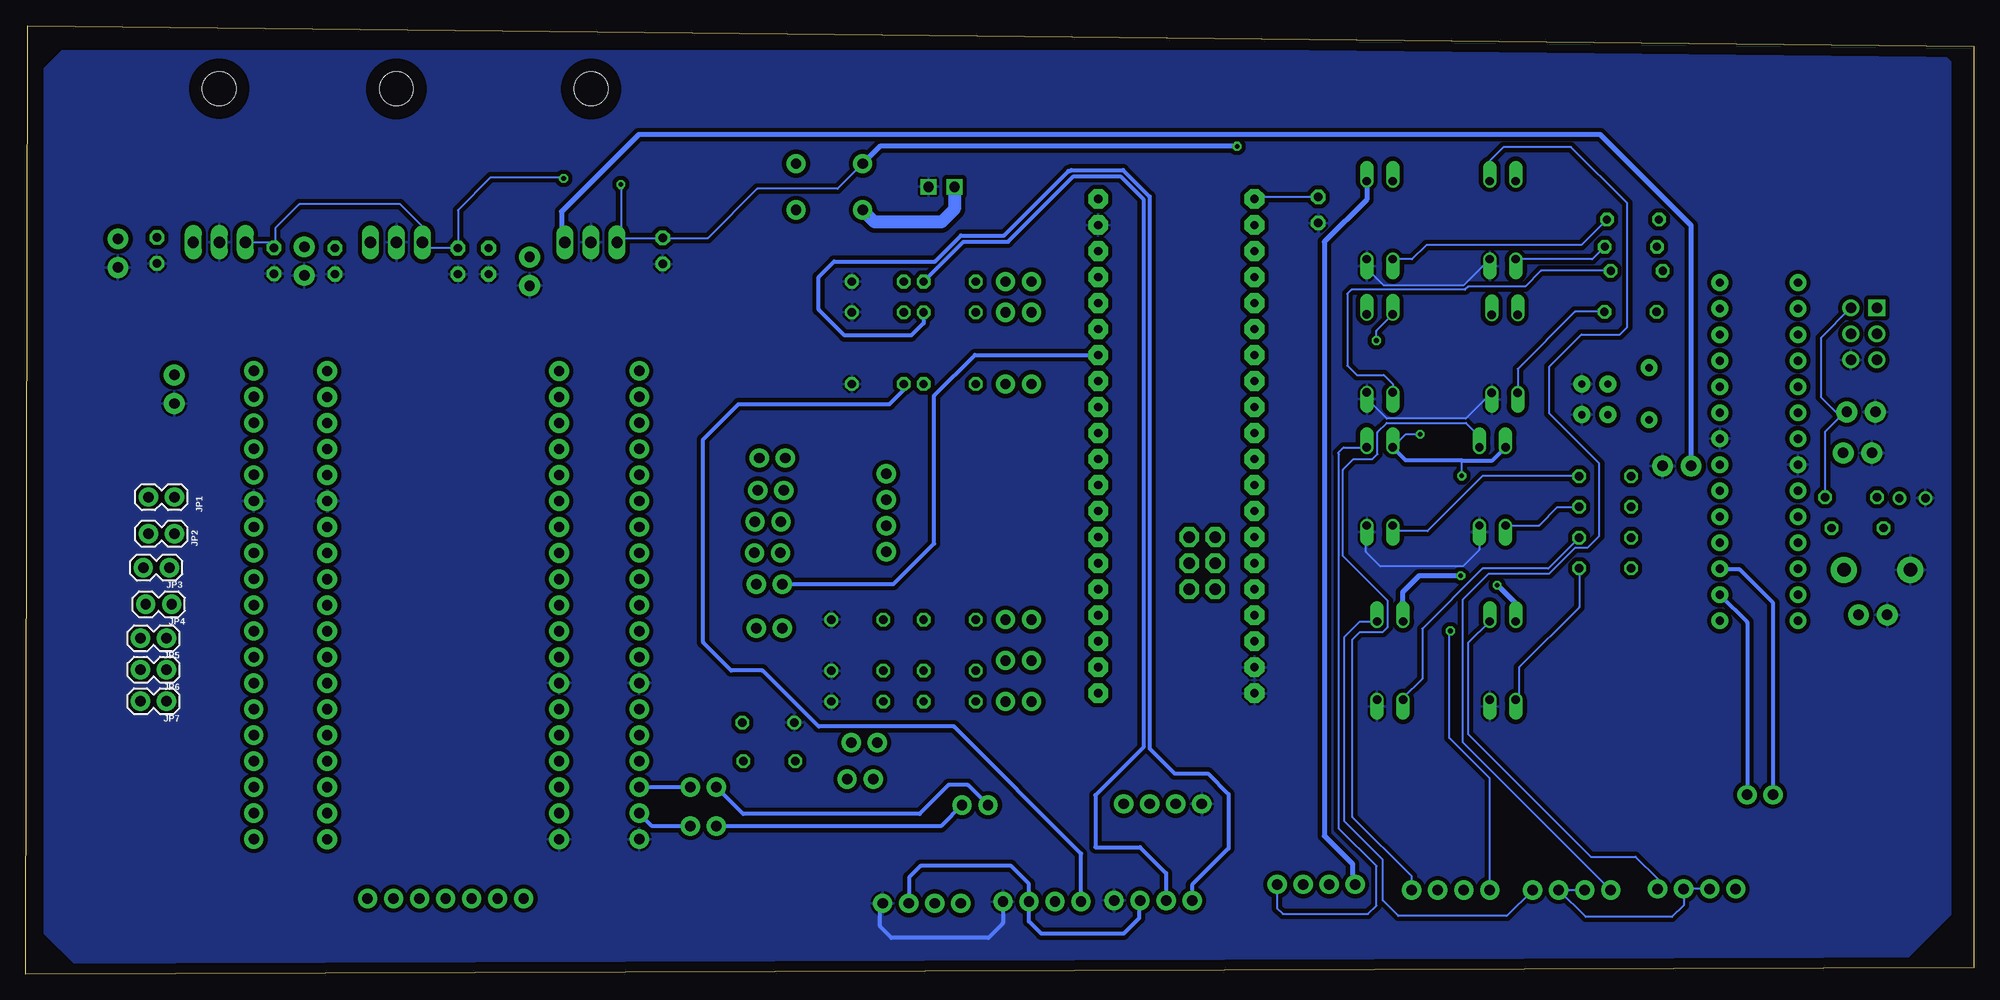
[diagram p4: board, bottom side, seen from below]

Size 190.2 x 92.63 mm. Coordinates in mm from the lower left corner, seen from the top.
Outline: 0,0.63 190.2,0 190,92.63 0,90.63 0,0.63
Copper layers (1*16): Top 0.035mm / dielectric 1.5mm / Bottom 0.035mm
Design rules "default *": minimum track width 6mil, minimum drill 0.35mm, track to track 8mil, track to pad 8mil, pad to pad 8mil, via to via 8mil, smd to smd 6mil, copper to edge 40mil, drill to drill 6mil, minimum pad ring 10mil, minimum via ring 8mil, stop-mask expansion 4mil, vias tented up to drill 0mil, thermal gap 10mil

### Footprints (pad centres in the part's own frame; a part is rotated, then mirrored left to right if it is on the bottom)
LED_3MM-NS = drill 0.813: A -1.27,0; K 1.27,0
1X02 = drill 1.016 pad 1.88: 1 0,0; 2 2.54,0
CAP-PTH-SMALL-KIT = drill 1.016 pad 2.032: 1 -1.397,0; 2 1.397,0
C025-024X044 = drill 0.813 pad 1.422 octagon: 1 -1.27,0; 2 1.27,0
CAP-PTH-2.54 = drill 0.7 pad 1.651: 1 -1.27,0; 2 1.27,0
HC49US = drill 0.7 pad 1.651: 1 -2.54,0; 2 2.54,0
1X04 = drill 1.016 pad 1.88: 1 0,0; 2 2.54,0; 3 5.08,0; 4 7.62,0
TO220H = drill 1.118 long: 1 -2.54,-10.16; 2 0,-10.16; 3 2.54,-10.16 | hole 3.302: 0,4.826
HEADER_PRG_2X03 = drill 1.02 pad 1.632 square: 1 -2.54,-1.27 | drill 1.02 pad 1.632: 2 -2.54,1.27; 3 0,-1.27; 4 0,1.27; 5 2.54,-1.27; 6 2.54,1.27
1X02_2.54_SCREWTERM = drill 1.016 square: P1 2.54,0; P2 0,0
1X19 = drill 1.016 pad 1.88: 1 0,0; 2 2.54,0; 3 5.08,0; 4 7.62,0; 5 10.16,0; 6 12.7,0; 7 15.24,0; 8 17.78,0; 9 20.32,0; 10 22.86,0; 11 25.4,0; 12 27.94,0; 13 30.48,0; 14 33.02,0; 15 35.56,0; 16 38.1,0; 17 40.64,0; 18 43.18,0; 19 45.72,0
1X07 = drill 1.016 pad 1.88: 1 0,0; 2 2.54,0; 3 5.08,0; 4 7.62,0; 5 10.16,0; 6 12.7,0; 7 15.24,0
DIL04 = drill 0.813 offset: 1 -1.27,-3.81; 2 1.27,-3.81; 3 1.27,3.81; 4 -1.27,3.81
0204/5 = drill 0.813 octagon: 1 -2.54,0; 2 2.54,0
TACTILE-PTH = drill 1.016 pad 1.88: 1 -3.251,2.261; 2 3.251,2.261; 3 -3.251,-2.261; 4 3.251,-2.261
TACT_PANA-EVQ = drill 1.3 pad 2.54: P$1 -3.25,0; P$2 3.25,0
DIP28 = drill 0.813 pad 1.626: 1 -16.51,-3.81; 2 -13.97,-3.81; 3 -11.43,-3.81; 4 -8.89,-3.81; 5 -6.35,-3.81; 6 -3.81,-3.81; 7 -1.27,-3.81; 8 1.27,-3.81; 9 3.81,-3.81; 10 6.35,-3.81; 11 8.89,-3.81; 12 11.43,-3.81; 13 13.97,-3.81; 14 16.51,-3.81; 15 16.51,3.81; 16 13.97,3.81; 17 11.43,3.81; 18 8.89,3.81; 19 6.35,3.81; 20 3.81,3.81; 21 1.27,3.81; 22 -1.27,3.81; 23 -3.81,3.81; 24 -6.35,3.81; 25 -8.89,3.81; 26 -11.43,3.81; 27 -13.97,3.81; 28 -16.51,3.81
ESP32-DEVKITC = drill 1 pad 1.93: 1 -22.87,-11.42; 2 -20.33,-11.42; 3 -17.79,-11.42; 4 -15.25,-11.42; 5 -12.71,-11.42; 6 -10.17,-11.42; 7 -7.63,-11.42; 8 -5.09,-11.42; 9 -2.55,-11.42; 10 -0.01,-11.42; 11 2.53,-11.42; 12 5.07,-11.42; 13 7.61,-11.42; 14 10.15,-11.42; 15 12.69,-11.42; 16 15.23,-11.42; 17 17.77,-11.42; 18 20.31,-11.42; 19 22.85,-11.42; 20 22.85,11.23; 21 20.31,11.23; 22 17.77,11.23; 23 15.23,11.23; 24 12.69,11.23; 25 10.15,11.23; 26 7.61,11.23; 27 5.07,11.23; 28 2.53,11.23; 29 -0.01,11.23; 30 -2.55,11.23; 31 -5.09,11.23; 32 -7.63,11.23; 33 -10.17,11.23; 34 -12.71,11.23; 35 -15.25,11.23; 36 -17.79,11.23; 37 -20.33,11.23; 38 -22.87,11.23
BLUE_PILL_ADV = drill 0.8 pad 1.93 octagon: P$1 10.16,-30.48; P$2 10.16,-27.94; P$3 10.16,-25.4; P$4 10.16,-22.86; P$5 10.16,-20.32; P$6 10.16,-17.78; P$7 10.16,-15.24; P$8 10.16,-12.7; P$9 10.16,-10.16; P$10 10.16,-7.62; P$11 10.16,-5.08; P$12 10.16,-2.54; P$13 10.16,0; P$14 10.16,2.54; P$15 10.16,5.08; P$16 10.16,7.62; P$17 10.16,10.16; P$18 10.16,12.7; P$19 10.16,15.24; P$20 10.16,17.78; P$21 -5.08,-30.48; P$22 -5.08,-27.94; P$23 -5.08,-25.4; P$24 -5.08,-22.86; P$25 -5.08,-20.32; P$26 -5.08,-17.78; P$27 -5.08,-15.24; P$28 -5.08,-12.7; P$29 -5.08,-10.16; P$30 -5.08,-7.62; P$31 -5.08,-5.08; P$32 -5.08,-2.54; P$33 -5.08,0; P$34 -5.08,2.54; P$35 -5.08,5.08; P$36 -5.08,7.62; P$37 -5.08,10.16; P$38 -5.08,12.7; P$39 -5.08,15.24; P$40 -5.08,17.78 | drill 1.1 pad 1.93 octagon: P$42 -1.27,-20.32; P$43 -1.27,-17.78; P$44 -1.27,-15.24; P$45 1.27,-15.24; P$46 1.27,-17.78; P$47 1.27,-20.32

### Placement (x,y rotation side)
AT_LED  6.01,46.49 180 top
AT_UART  22.14,17.52 180 top
C1  29,49.63 0 top
C2  165.95,69.67 270 top
C3  177.38,70.67 270 top
C4  11.01,54.9 180 top
C5  148,69.63 270 top
C6  160,69.63 270 top
C7  11.36,50.9 180 top
C8  128,70.63 270 top
C9  145,69.63 270 top
C10  181.19,70.4 270 top
C11  163,69.63 270 top
C12  141,68.63 270 top
C13  37,57.63 180 top
C14  37,54.63 180 top
C15  9.86,35.09 180 top
CRYST  31.71,56.68 270 top
ESP_D_CAPS  175.68,57.11 270 top
EXT_PIN_CONN  106.19,41.25 90 top
IC1  171.3,81.64 0 top
IC2  154,81.63 0 top
IC3  135,81.63 0 top
ICSP  10.74,62.53 270 top
J2  102.06,76.89 180 top
J3  130.29,13.19 90 top
J4  167.93,13.19 90 top
JP1  175.67,46.59 180 bottom
JP2  175.67,43.01 180 bottom
JP3  176.17,39.7 180 bottom
JP4  175.94,36.12 180 bottom
JP5  176.44,32.81 180 bottom
JP6  176.44,29.73 180 bottom
JP7  176.44,26.65 180 bottom
JP8  118.72,47.24 180 top
JP9  119,44.17 180 top
JP10  119.05,41.14 180 top
JP11  118.57,50.4 180 top
JP12  125.32,18.27 180 top
JP13  125.32,14.46 180 top
JP14  118.86,33.78 180 top
JP15  118.86,38.09 180 top
JP16  92,67.63 0 top
JP17  92,26.63 0 top
JP18  92,30.63 0 top
JP19  92,64.63 0 top
JP20  92,34.63 0 top
JP21  92,57.63 0 top
JP22  109.59,22.62 180 top
JP23  110,19.04 180 top
LIMIT_SW_CONN  141.58,7.39 0 top
MOTOR_X  30.87,8.33 180 top
MOTOR_Y1  54.88,8.22 180 top
MOTOR_Y2  43.07,8.21 180 top
MOTOR_Z  68.02,8.77 180 top
OK1  58,47.63 0 top
OK2  58,73.63 0 top
OK3  47,47.63 0 top
OK4  46,30.63 0 top
OK5  45.8,60.59 0 top
OK6  58,60.63 0 top
OK7  57,30.63 0 top
OK8  46,73.63 0 top
R1  100,26.63 0 top
R2  100,29.63 0 top
R3  100,64.63 0 top
R4  100,67.63 0 top
R5  100,34.63 0 top
R6  100,57.63 0 top
R7  11.37,43.57 180 top
R8  11.99,46.57 180 top
R9  36,39.63 0 top
R10  36,45.63 0 top
R11  36,48.63 0 top
R12  33.53,64.69 0 top
R13  32.91,68.69 0 top
R14  33.29,73.69 0 top
R15  36,42.63 0 top
R16  33.49,71.04 0 top
R17  109,26.63 180 top
R18  109,29.63 180 top
R19  117.59,20.81 0 top
R20  117.7,24.58 180 top
R21  107,57.63 180 top
R22  109,34.63 180 top
R23  107,64.63 180 top
R24  107,67.63 180 top
S1  111.74,76.89 180 top
STM_D_CAPS1  64,74.63 270 top
STM_UART  83,16.63 180 top
SW1  9.44,39.49 180 top
U1  20.99,51.02 90 top
U$1  149.34,36.05 90 top
U$2  75.33,57.92 0 top
UART_HPINS  98.79,16.52 180 top
X_CONN  98.91,6.91 0 top
Y1_CONN  76.32,7.19 0 top
Y2_CONN  87.17,7.09 0 top

### Tracks (layer width: path | path; a pad name or v marks a point on that pad's centre or on a via)
3V3
  Top 0.406: U$1.1 J4.1
12V
  Bottom 1.27: J2.P1 99.52,74.72 100.79,73.45 107.31,73.45 S1.2
12V_SIN  (via drill 0.45)
  Top 0.203: v54.06,52.72 54.06,57.6 v58.33,61.86 | OK6.4 56.73,65.8 | 44.71,64.58 OK5.4 | v137.68,77.71 132.7,77.71 v132.09,77.1
  Top 0.508: v46.54,37.99 47.45,38.9 | 47.45,38.9 v50.1,38.9 | 47.45,38.9 49.99,41.44 v49.99,48.66 | 56.73,65.8 55.58,66.94 53.86,66.94 | 53.86,66.94 45.12,66.94 44.71,66.54 44.71,64.58 41.77,67.52 41.77,74.47 OK8.4 | 53.86,66.94 53.86,74.56 OK2.4 56.73,79.27 59.14,81.68 71,81.68 v71.94,80.84
  Bottom 0.203: 55.79,34.49 OK7.4 | v49.99,48.66 49.99,50.18 | OK1.4 55.45,52.72 v54.06,52.72 | v58.33,61.86 58.33,62.84 OK6.4 | S1.4 108.56,79.08 110.94,76.7 118.78,76.7 123.58,71.9 C8.1 132.03,71.9 IC3.1 132.09,71.84 v132.09,77.1 | v137.68,77.71 137.78,77.82 144.79,77.82 148,74.6 C5.1 150.89,70.9 IC2.1 151.46,73.01 153.63,75.17 163.48,75.17 165.82,72.84 165.82,71.07 165.9,70.99 | 165.9,70.99 C2.1 | IC1.1 166.39,71.48 165.9,70.99
  Bottom 0.406: OK3.4 46.99,50.18 49.99,50.18 55.47,50.18 OK1.4
  Bottom 0.508: OK4.4 44.73,36.18 v46.54,37.99 | v50.1,38.9 54.16,38.9 55.79,37.28 55.79,34.49 | v71.94,80.84 106.79,80.84 108.56,79.08
AT_5V
  Top 0.203: 25,49.75 U1.7 | 27.48,49.75 C1.1 | C4.1 17.11,54.9 U1.20 | R7.2 10.36,45.1 13.11,45.1 14.53,46.52 R8.1
  Top 0.406: IC3.3 139.56,71.47 C12.1 144.13,70.02 C9.1
  Top 0.508: 27.48,49.75 25,49.75 23.2,49.75 22.66,50.28 22.66,51.7 19.54,54.83 U1.20
  Bottom 0.203: ICSP.2 14.94,62.13 14.94,56.38 13.46,54.9 12.61,54.9 | 12.61,54.9 C4.1 | R8.1 14.53,52.97 12.61,54.9 | 137.88,71.8 IC3.3
  Bottom 0.508: C1.1 27.6,73.1 36.48,81.98 130.36,81.98 137.88,74.46 137.88,71.8
AT_JRX
  Top 0.203: AT_UART.1 22.56,17.09 22.56,13.1 20.94,11.47 20.94,6.19 24.49,2.63 109.94,2.63 112.07,4.76 112.07,7.2 109.33,9.95 106.89,9.95 106.79,9.84 103.64,12.99 103.64,21.94 104.66,22.95 106.71,22.95 JP22.2
  Bottom 0.406: U1.2 22.14,34.39 AT_UART.1
AT_JTX
  Top 0.203: AT_UART.2 19.6,5.39 23.32,1.67 110.19,1.67 112.58,4.05 112.58,7.51 109.63,10.45 106.99,10.45 104.05,13.4 104.05,17.77 105.31,19.04 JP23.2
  Bottom 0.406: AT_UART.2 19.6,36.24 22.87,39.51 24.73,39.51 U1.3
AT_MISO
  Top 0.203: U1.18 18.37,59.91 19.62,61.15 19.62,68.47 18.6,69.48 10.67,69.48 9.46,68.26 9.46,65.08 ICSP.1
AT_MOSI
  Top 0.203: ICSP.4 17.1,62.53 U1.17
AT_RESET
  Top 0.203: C15.1 12.69,36.52 | 12.69,36.52 SW1.P$1 13.91,40.71 R7.1 12.5,42.15 7.32,42.15 5.9,43.58 5.9,57.5 8.39,59.99 ICSP.5 | 12.69,36.52 13.35,35.85 18.4,35.85 19.75,34.51 U1.1
AT_RX
  Top 0.406: U$1.34 J3.5 127.43,26.2 114.31,26.2 110.72,22.62 JP22.1
AT_SCK
  Top 0.203: ICSP.3 9.47,62.15 10.67,60.95 10.67,59.32 12.63,57.37 U1.19
AT_TX
  Top 0.406: U$1.35 J3.4 R19.2 120.24,20.92 R20.1
CLK
  Top 0.406: J3.19 U$1.20
CMD
  Top 0.406: U$1.18 J4.18
DIR_X
  Top 0.203: R12.1 29.58,64.69 U1.11
DIR_XO
  Top 0.203: 46.94,64.4 OK5.3
  Top 0.508: MOTOR_X.4 23.25,10.02 41.16,27.93 41.16,58.61 46.94,64.4
DIR_Y
  Top 0.203: U1.12 30.37,68.02 30.37,68.47 | 30.37,68.47 R13.1 | R16.1 30.37,70.46 30.37,68.47
DIR_Y1O  (via drill 0.45)
  Top 0.203: v51.11,33.52 51.11,56.28 OK6.3
  Bottom 0.203: MOTOR_Y1.4 47.26,19.1 51.21,23.05 51.21,33.42 v51.11,33.52
DIR_Y2O
  Bottom 0.203: MOTOR_Y2.4 49.89,22.65 49.89,36.57 47.35,39.11 41.46,39.11 38.92,41.65 37.7,41.65 36.58,42.76 36.58,49.88 41.46,54.75 41.46,59.32 38.31,62.47 34.55,62.47 33.84,63.18 33.84,75.28 39.33,80.76 45.93,80.76 47.27,79.42 OK8.3
DIR_Z
  Top 0.203: U1.13 29.27,69.45 29.27,72.23 30.73,73.69 R14.1
DIR_ZO
  Bottom 0.203: 60.66,9.03 MOTOR_Z.4
  Bottom 0.508: OK2.3 59.27,75.65 63.41,71.52 63.41,13.5 60.66,10.76 60.66,9.03
EN
  Top 0.406: U$1.2 J4.2
ENC_X_GR
  Top 0.406: U$2.P$16 91.09,65.54 JP19.1
ENC_X_JGR
  Top 0.406: R3.2 R23.2
  Bottom 0.406: R3.2 102.54,63.57 103.74,62.37 110.24,62.37 112.78,64.91 112.78,68.06 111.26,69.59 101.44,69.59 98.9,72.13 94.7,72.13 88.4,78.42 88.25,78.42 88.14,78.53 83.07,78.53 80.47,75.93 80.47,22.04 78.04,19.6 74.78,19.6 72.75,17.57 72.75,12.28 76.32,8.71 Y1_CONN.1
ENC_X_JWH
  Top 0.406: R24.2 R4.2
  Bottom 0.406: R4.2 98.65,71.52 94.29,71.52 87.89,77.92 83.32,77.92 81.08,75.68 81.08,22.14 85.76,17.46 85.76,12.38 81.39,12.38 78.86,9.86 Y1_CONN.2
ENC_X_WH
  Top 0.406: U$2.P$17 91.55,68.08 JP16.1
ENC_Y1_GR
  Top 0.406: U$2.P$1 91.19,27.44 JP17.1
ENC_Y1_JGR
  Top 0.406: R17.2 R1.2 102.54,12.87 106.38,9.03 108.41,9.03 110.34,7.1 110.34,5.98 108.41,4.05 99.78,4.05 98.97,4.87 98.97,6.86 X_CONN.1
ENC_Y1_JWH
  Top 0.406: R18.2 R2.2 101,28.08 101,19.7 101.45,19.24 X_CONN.2
ENC_Y1_WH
  Top 0.406: U$2.P$2 91.35,29.98 JP18.1
ENC_Y2_GR
  Top 0.406: U$2.P$13 91.71,57.92 JP21.1
ENC_Y2_JGR
  Top 0.406: R21.2 R6.2
  Bottom 0.406: Y2_CONN.1 87.17,11.76 99.58,24.17 112.78,24.17 118.27,29.66 121.32,29.66 124.06,32.4 124.06,52.21 120.61,55.67 105.87,55.67 104.46,57.08 R21.2
ENC_Y2_JWH
  Top 0.406: 102.83,34.63 R22.2 | 102.83,34.63 R5.2 | Y2_CONN.2 90.03,7.4 90.03,15.74 99.78,25.49 99.78,31.49 102.83,34.53 102.83,34.63
ENC_Y2_WH
  Top 0.406: U$2.P$4 91.57,35.06 JP20.1
ESP32_5V
  Top 0.406: U$1.19 J4.19 | 175.35,58.91 ESP_D_CAPS.1 175.43,58.77 175.29,58.91 | IC1.3 175.37,71.48 175.83,71.94 C3.1 181.05,71.94 C10.1
  Top 0.508: J4.19 175.29,58.91 | IC1.3 175.68,69.63 175.68,59.03 175.43,58.77
ESP32_I2C_JSCL
  Top 0.406: JP14.2 116.32,34.25 112.48,38.09 104.86,38.09 101.61,41.34 101.61,56.38 97.14,60.85 89.01,60.85 87.18,62.68 85.81,62.68 U$2.P$15
ESP32_I2C_JSDA
  Bottom 0.406: JP15.2 105.47,38.09 101.51,42.05 101.51,56.48 97.53,60.46 U$2.P$14
ESP32_I2C_SCL
  Top 0.406: U$1.29 J3.10 121.13,36.05 JP14.1
ESP32_I2C_SDA
  Top 0.406: U$1.28 J3.11 129.79,38.09 JP15.1
ESP32_JRX
  Bottom 0.406: UART_HPINS.2 98.22,18.48 100.08,18.48 102.93,15.64 120.15,15.64 JP12.2
ESP32_JTX
  Bottom 0.406: UART_HPINS.1 100.85,14.46 JP13.2
ESP32_RX
  Top 0.406: U$1.36 J3.3
  Bottom 0.406: J3.3 JP12.1
ESP32_TX
  Top 0.406: J3.2 U$1.37
  Bottom 0.406: JP13.1 129.02,14.46 J3.2
EXT_P1
  Top 0.406: 130.46,48.74 U$1.24 | 130.46,48.74 J3.15 | JP11.1 120.23,48.74 130.46,48.74
EXT_P2
  Top 0.406: U$1.25 J3.14 119.75,46.21 JP8.1
EXT_P3
  Top 0.406: U$1.26 J3.13 129.78,44.17 JP9.1
EXT_P4
  Top 0.406: J3.12 | J3.12 U$1.27 | JP10.1 119.07,41.12 J3.12
EXT_PJ1
  Top 0.406: JP11.2 107.72,50.4 EXT_PIN_CONN.4
EXT_PJ2
  Top 0.406: EXT_PIN_CONN.3 115.27,46.33 JP8.2
EXT_PJ3
  Top 0.406: EXT_PIN_CONN.2 106.58,44.17 JP9.2
EXT_PJ4
  Top 0.406: JP10.2 106.3,41.14 EXT_PIN_CONN.1
GND
  Top 0.406: C10.2 177.78,69 C3.2
  Bottom 0.203: OK8.2 49.84,67.25 57.61,67.25 59.27,68.9 OK2.2 | OK3.2 48.27,41.44 49.89,39.82 57.92,39.82 59.34,41.24 59.34,43.74 OK1.2 | OK5.2 49.6,54.24 57.31,54.24 59.27,56.2 OK6.2
  Bottom 0.406: Y2_CONN.4 94.79,4.98 96.22,3.55 105.67,3.55 106.79,4.66 106.79,6.66 X_CONN.4
  pour Top (isolate 0.406): 186.75,90.01 188.37,88.38 188.37,3.85 187.76,3.24 185.33,0.8 180.55,0.8 7.12,0.8 2.04,5.88 2.04,88.89 3.16,90.01
  pour Bottom (isolate 0.406): 2.24,88.79 2.24,5.78 7.22,0.8 185.22,0.8 188.37,3.95 188.37,88.48 186.65,90.21 3.36,90.21 2.24,89.09
IO13
  Top 0.406: U$1.15 J4.15
IO15
  Top 0.406: J3.16 U$1.23
IO18
  Top 0.406: J3.9 U$1.30
IO19
  Top 0.406: J3.8 U$1.31
IO21
  Top 0.406: U$1.33 J3.6
IO34
  Top 0.406: U$1.5 J4.5
IO35
  Top 0.406: U$1.6 J4.6
LIMIT_SW1
  Top 0.406: U$1.13 J4.13 167.97,43.63 173,43.63 175.67,46.3 JP1.1
LIMIT_SW2
  Top 0.406: U$1.12 J4.12 168.43,41.63 174,41.63 175.38,43.01 JP2.1
LIMIT_SW3
  Top 0.406: U$1.11 J4.11 167.97,38.63 174,38.63 175.07,39.7 JP3.1
LIMIT_SW4
  Top 0.406: U$1.10 J4.10 168.35,35.63 174,35.63 174.49,36.12 JP4.1
LIMIT_SW5
  Top 0.406: U$1.9 J4.9 168.05,33.63 170,33.63 170.82,32.81 JP5.1
LIMIT_SW6
  Top 0.406: U$1.8 J4.8 168.27,30.63 170,30.63 170.9,29.73 JP6.1
LIMIT_SW7
  Top 0.406: U$1.7 J4.7 168.13,28.63 170,28.63 171.98,26.65 JP7.1
LIMIT_SWJ1
  Top 0.406: JP1.2 179.67,46.59 180.55,45.71 180.55,42.91 180.67,42.8 180.67,39.04 185.53,34.18 185.53,12.49 178.41,5.37 164.34,5.37 160.55,1.58 152.42,1.58 150.21,3.79 145.18,3.79 LIMIT_SW_CONN.1
LIMIT_SWJ2
  Top 0.406: JP2.2 179.6,43.01 180.04,42.56 180.04,40.27 180.06,40.25 180.06,38.79 184.82,34.03 184.82,33.62 184.92,33.51 184.92,12.74 178.16,5.98 164.09,5.98 160.84,2.73 160.78,2.73 160.24,2.19 152.67,2.19 150.29,4.57 146.93,4.57 LIMIT_SW_CONN.2
LIMIT_SWJ3
  Top 0.406: JP3.2 178.71,38.61 180.04,37.28 180.55,37.28 184.21,33.62 184.21,33.36 184.31,33.26 184.31,13 177.91,6.59 163.78,6.59 159.99,2.8 152.93,2.8 150.46,5.26 148.79,5.26 LIMIT_SW_CONN.3
LIMIT_SWJ4
  Top 0.406: JP4.2 178.64,35.96 180.75,35.96 183.7,33.01 183.7,13.4 183.5,13.2 183.5,13.05 177.75,7.3 163.63,7.3 159.73,3.41 153.41,3.41 151.21,5.6 150.98,5.6 LIMIT_SW_CONN.4
LIMIT_SWJ5
  Top 0.406: 179.16,32.63 JP5.2 181.26,32.81 182.89,31.18 182.89,13.3 177.5,7.91 163.38,7.91 159.48,4.02 153.66,4.02 151.74,5.94 LIMIT_SW_CONN.5
LIMIT_SWJ6
  Top 0.406: JP6.2 179.08,29.63 181,29.63 182,28.63 182,13.63 177,8.63 163,8.63 159,4.63 156,4.63 154.28,6.35 LIMIT_SW_CONN.6
LIMIT_SWJ7
  Top 0.406: JP7.2 178.98,13.61 176,10.63 160.06,10.63 LIMIT_SW_CONN.7
N$1
  Top 0.203: U1.10 29.86,57.37 CRYST.1 34.14,59.22 C13.2
N$2
  Top 0.203: U1.9 31.02,54.83 CRYST.2 35.24,54.14 C14.2
N$3
  Top 0.203: AT_LED.A 9.37,46.49 R8.2
N$5
  Top 0.203: C7.1 15.79,50.9 U1.21
N$6
  Bottom 0.203: R9.2 38.54,35.83 44.41,29.96 44.41,27.14 OK4.1
N$7
  Bottom 0.203: OK3.1 42.44,43.82 40.65,45.61 38.56,45.61 R10.2
N$8
  Bottom 0.203: R11.2 47.99,48.63 53.35,43.27 56.19,43.27 OK1.1
N$9
  Bottom 0.203: R12.2 38.94,64.69 44.53,59.1 OK5.1
N$10
  Bottom 0.203: R14.2 38.3,71.21 53.45,71.21 54.84,69.82 OK2.1
N$11
  Bottom 0.203: R13.2 42.26,68.69 43.8,67.15 49.36,67.15 49.67,66.84 60.76,66.84 61.17,66.44 61.17,59.43 60.26,58.51 57.61,58.51 56.73,57.63 OK6.1
N$12
  Bottom 0.203: R15.2 41.55,39.61 47.96,39.61 53.86,33.72 53.86,28.84 55.73,26.97 OK7.1
N$13
  Bottom 0.203: R16.2 37.25,69.82 OK8.1
N$14
  Top 0.406: R3.1 JP19.2
N$15
  Top 0.406: JP16.2 R4.1
N$16
  Top 0.406: JP23.1 110.06,19.09 111.87,19.09 113.58,20.81 R19.1
N$17
  Top 0.406: JP18.2 96.46,30.63 R2.1
N$18
  Top 0.406: JP17.2 R1.1
N$19
  Top 0.406: JP21.2 R6.1
N$20
  Top 0.406: JP20.2 R5.1
SD0
  Top 0.406: J3.18 U$1.21
SD1
  Top 0.406: U$1.22 J3.17
SD2
  Top 0.406: U$1.16 J4.16
SD3
  Top 0.406: U$1.17 J4.17
SMP_GND
  Top 0.203: MOTOR_Y2.2 40.53,7.01 42.37,5.17 46.75,5.17 MOTOR_Y1.3 MOTOR_Y1.2 52.34,6.99 53.96,5.37 61.78,5.37 63,6.59 62.94,6.65 MOTOR_Z.3 MOTOR_Z.2
  Bottom 0.203: MOTOR_Y2.3 MOTOR_Y2.2 37.9,5.58 29.47,5.58 28.33,6.72 MOTOR_X.2 MOTOR_X.3
STEP_X
  Top 0.203: U1.4 30.96,42.13 R9.1
STEP_XO
  Bottom 0.203: OK4.3 49.38,32.32 49.38,23.46 37.4,11.47 33.03,11.47 30.87,9.31 MOTOR_X.1
STEP_Y
  Top 0.203: U1.5 32.5,44.67 R10.1 R15.1
STEP_Y1O
  Bottom 0.203: MOTOR_Y1.1 54.88,9.55 60.66,15.33 60.66,32.7 59.95,33.42 57.72,33.42 57.21,33.92 57.21,36.46 61.58,40.83 61.58,49.27 60.56,50.28 58.73,50.28 58.22,50.79 58.22,52.92 57.31,53.84 49.59,53.84 48.27,52.52 OK3.3
STEP_Y2O
  Bottom 0.203: MOTOR_Y2.1 45.6,5.68 56.19,5.68 57.72,7.2 57.72,11.17 61.48,14.92 61.48,32.91 59.95,34.44 OK7.3
STEP_Z
  Top 0.203: U1.6 32.04,47.21 R11.1
STEP_ZO
  Bottom 0.203: MOTOR_Z.1 68.02,6.43 67.47,5.88 59.14,5.88 58.33,6.7 58.33,10.56 61.98,14.21 61.98,50.79 62.09,50.89 61.54,51.44 OK1.3
STM_5V
  Top 0.406: U$2.P$18 80.59,70.62 79.25,69.28 79.25,21.63 77.92,20.3 STM_UART.3
STM_RX
  Top 0.406: U$2.P$6 83.13,40.14 81.9,38.9 81.9,19.09 82.71,18.28 82.71,16.92 STM_UART.1
STM_TX
  Top 0.406: STM_UART.2 80.46,41.02 81.69,42.26 85.07,42.26 U$2.P$7
STM_VBAT
  Top 0.406: C11.1 162.87,70.9 C6.1 157.11,70.9 IC2.3 156.67,71.6 156.67,74.26 155.86,75.07 135.75,75.07 135.64,75.17 122.44,75.17 114.92,82.69 77.25,82.69 U$2.P$40 72.43,75.7 78.54,69.59 78.54,22.95 73.26,17.67 73.26,12.59 74.89,10.96 79.25,10.96 81.4,8.81 Y1_CONN.3
  Bottom 0.203: STM_D_CAPS1.1 70.05,75.9 U$2.P$40
  Bottom 0.406: 92.25,7.51 Y2_CONN.3 | 92.25,7.51 92.25,8.82 93.99,10.56 102.83,10.56 103.94,9.44 103.94,6.96 X_CONN.3 | Y1_CONN.3 81.49,7.1 81.49,5.48 83.01,3.95 91.04,3.95 92.25,5.16 92.25,7.51
SVN
  Top 0.406: U$1.4 J4.4
SVP
  Top 0.406: U$1.3 J4.3

### Text on the board
tNames: 12V | GND | SDA | SCL | Rx | Tx | Rx | Tx | STEP+ | STEP+ | STEP+ | STEP+ | DIR+ | DIR+ | DIR+ | DIR+ | DIR- | STEP- | DIR- | STEP- | DIR- | STEP- | DIR- | STEP- | GREEN | WHITE | 5V | GND | GREEN | WHITE | 5V | GND | GREEN | WHITE | 5V | GND